# EAGLE design Diag_586220_Cassette (EAGLE 9.5.2)
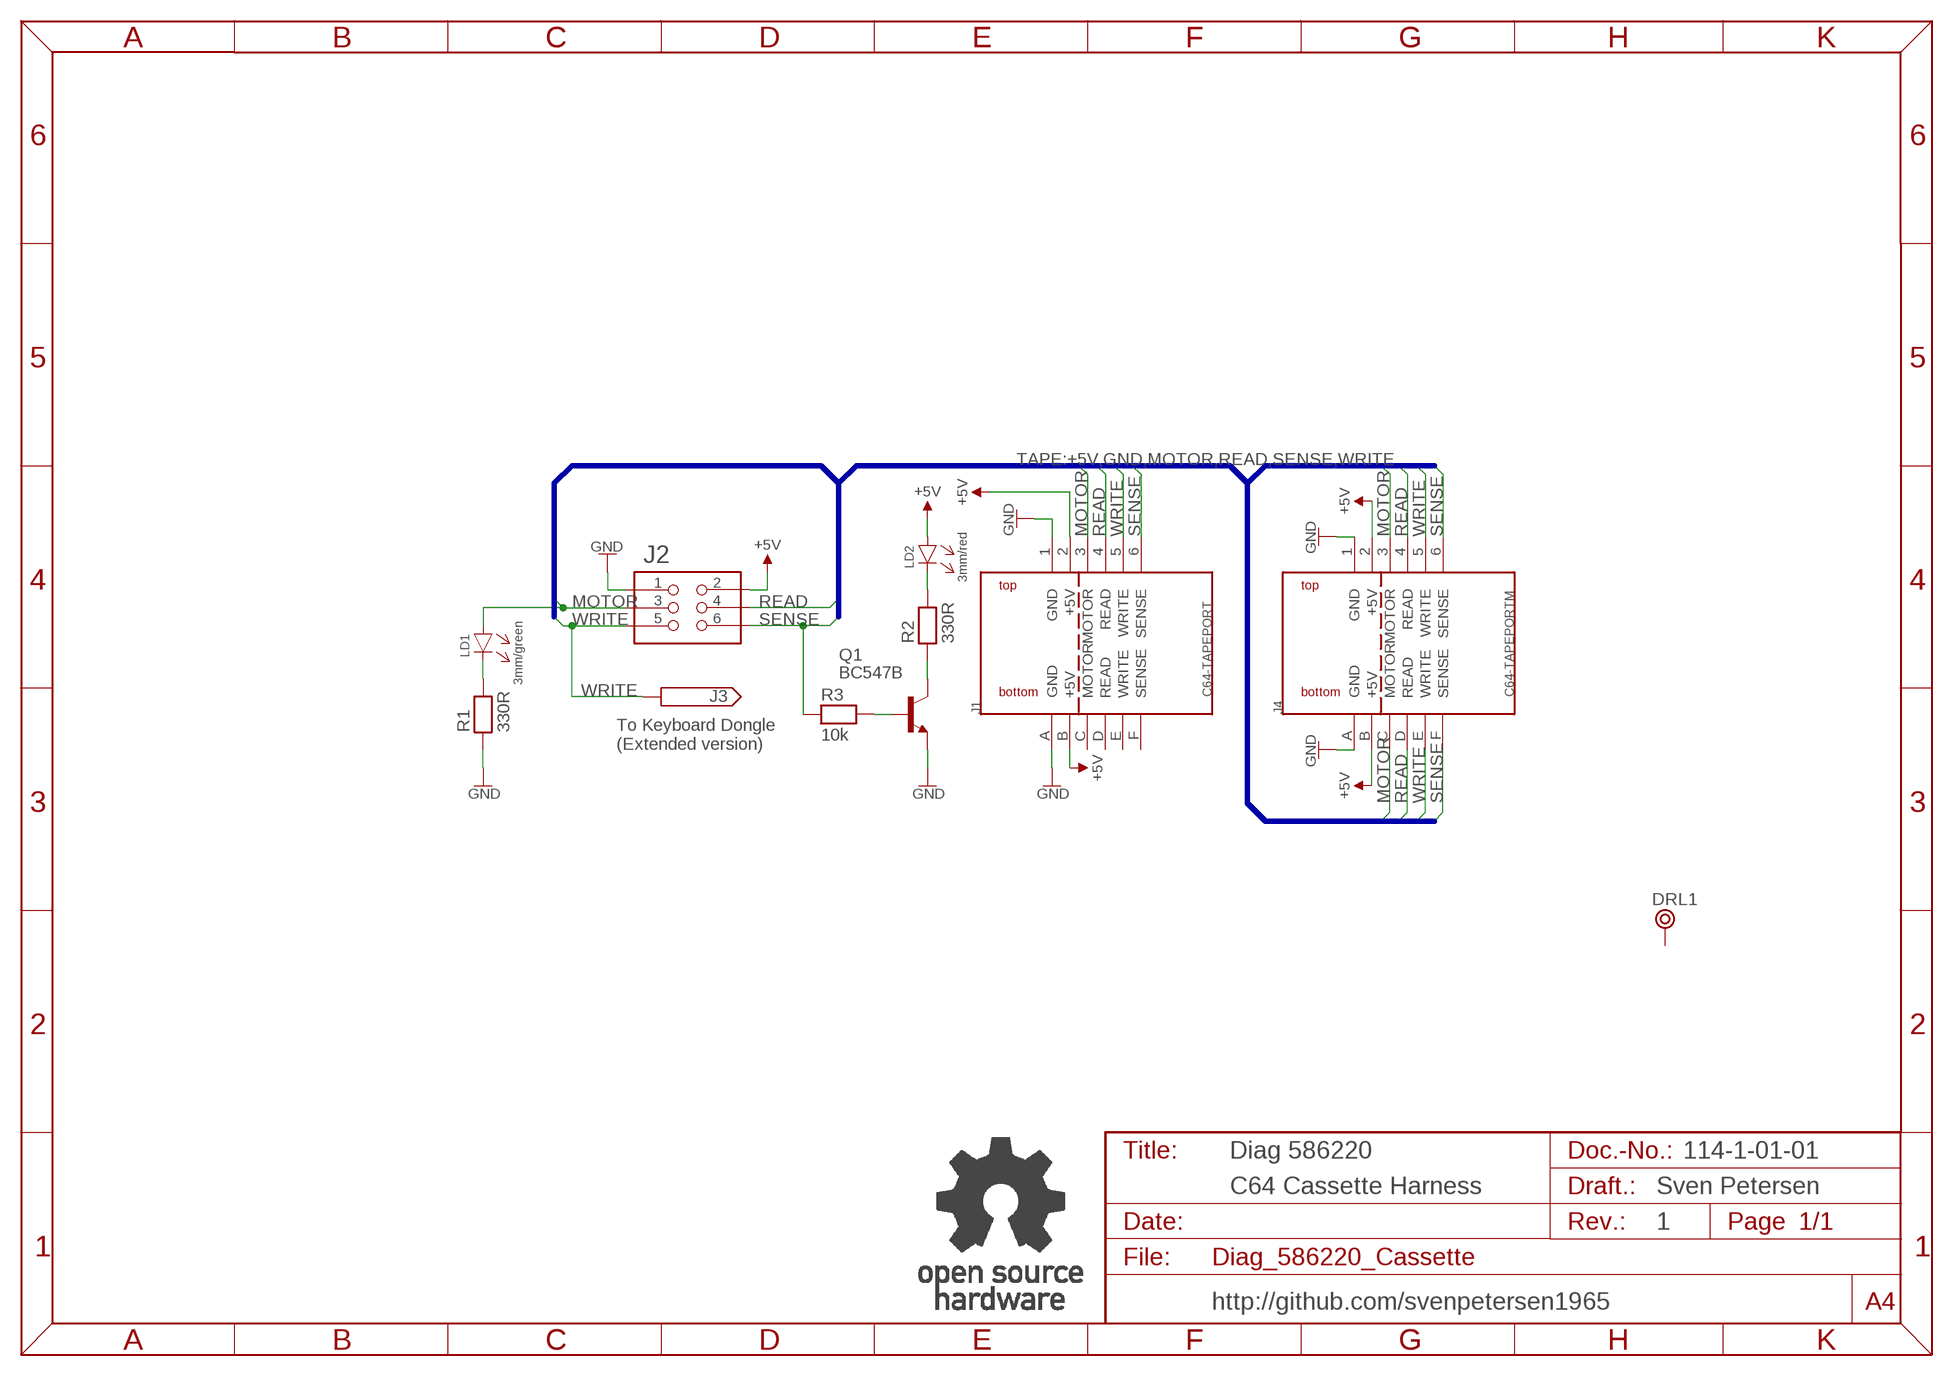
[diagram p0: schematic, sheet 1]

## Parts
DRL1  BOHR3,5  [BOHR3,5]
J1  C64-TAPEPORT  [TAPEPORT]
J2  2X03WV  [2X03WV]
J3  PINHD-1X1  [1X01]
J4  C64-TAPEPORTM  [TAPEPORT_M]
LD1  3mm/green  3MM  [3MM]
LD2  3mm/red  3MM  [3MM]
Q1  BC547B  [TO92]
R1  330R  RES04  [R-10]
R2  330R  RES04  [R-10]
R3  10k  RES04  [R-10]
U$18  OPEN_SOURCE_HW  [OPENHW]

## Nets
+5V: J1.2(+5V) J1.B(+5V) J2.2 J4.2(+5V) J4.B(+5V) LD2.A
GND: J1.1(GND) J1.A(GND) J2.1 J4.1(GND) J4.A(GND) Q1.1(E) R1.1
MOTOR: J1.3(MOTOR) J2.3 J4.3(MOTOR) J4.C(MOTOR) LD1.A
N$1: LD1.C(K) R1.2
N$2: Q1.2(B) R3.2
N$3: Q1.3(C) R2.1
N$4: LD2.C(K) R2.2
READ: J1.4(READ) J2.4 J4.4(READ) J4.D(READ)
SENSE: J1.6(SENSE) J2.6 J4.6(SENSE) J4.F(SENSE) R3.1
WRITE: J1.5(WRITE) J2.5 J3.1 J4.5(WRITE) J4.E(WRITE)
Unconnected: DRL1.P$1 J1.C(MOTOR) J1.D(READ) J1.E(WRITE) J1.F(SENSE)

## Buses
TAPE:+5V,GND,MOTOR,READ,SENSE,WRITE

## Notes on the sheet
- To Keyboard Dongle 
  (Extended version)
- Diag 586220 | 114-1-01-01
- C64 Cassette Harness | Sven Petersen
- 1
- http://github.com/svenpetersen1965

## Library data of the parts
DRL1 = Mech_Bohr:BOHR3,5
J1 J4 = Commodore:C64-TAPEPORT
J2 = PINHEAD:2X03WV
J3 = PINHEAD:PINHD-1X1
LD1 LD2 = LED:3MM
Q1 = Transistoren:BC547*: NPN Transistor
R1-R3 = DISCRETE:RES04
U$18 = Logo:OPEN_SOURCE_HW

## Board
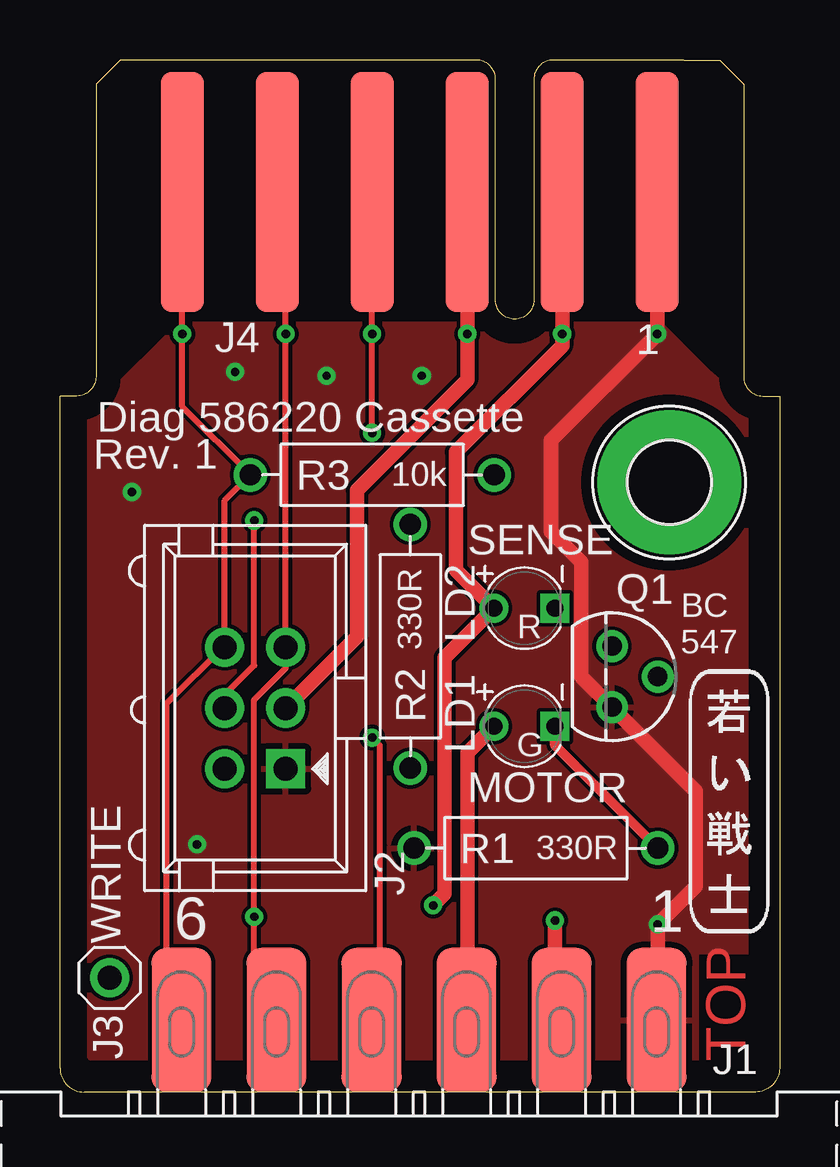
[diagram p1: board, top side]
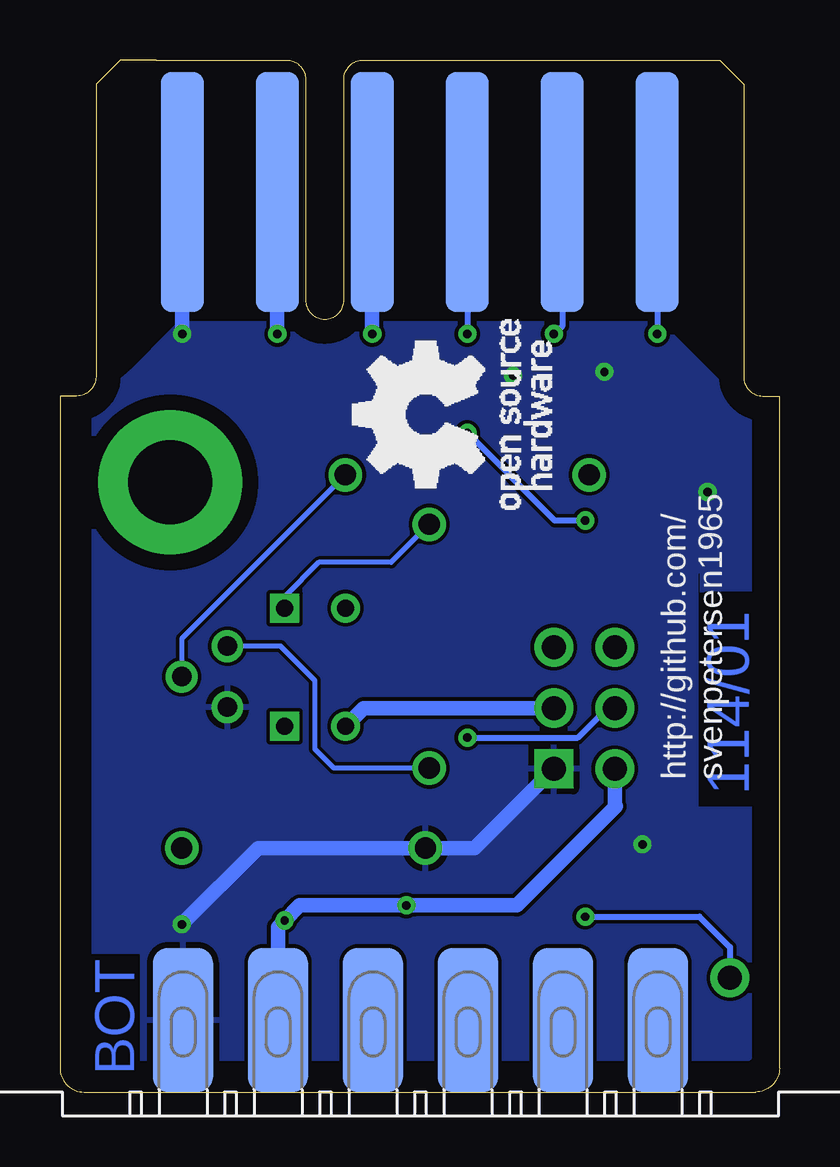
[diagram p2: board, bottom side, seen from below]

Size 30 x 43 mm. Coordinates in mm from the lower left corner, seen from the top.
Outline: 28.5,31 28.5,29.8 arc90 29.3,29 30,29 30,1 arc-90 29,0 1,0 arc-90 0,1 0,29 0.7,29 arc90 1.5,29.8 1.5,31
Copper layers (1*16): Top 0.035mm / dielectric 1.5mm / Bottom 0.035mm
Design rules "default *": minimum track width 6mil, minimum drill 0.35mm, track to track 6mil, track to pad 6mil, pad to pad 6mil, via to via 6mil, smd to smd 6mil, copper to edge 40mil, drill to drill 6mil, minimum pad ring 10mil, minimum via ring 8mil, stop-mask expansion 4mil, vias tented up to drill 24mil, thermal gap 10mil
bRestrict: 2 lines

### Footprints (pad centres in the part's own frame; a part is rotated, then mirrored left to right if it is on the bottom)
BOHR3,5 = drill 3.5 pad 6: P$1 0,0
TAPEPORT = smd 2.5 x 6: 1 -9.9,-3; 2 -5.94,-3; 3 -1.98,-3; 4 1.98,-3; 5 5.94,-3; 6 9.9,-3 | smd 2.5 x 6 bottom: A -9.9,-3; B -5.94,-3; C -1.98,-3; D 1.98,-3; E 5.94,-3; F 9.9,-3
2X03WV = drill 1 pad 1.626 square: 1 -2.54,-1.27 | drill 1 pad 1.626: 2 -2.54,1.27; 3 0,-1.27; 4 0,1.27; 5 2.54,-1.27; 6 2.54,1.27
1X01 = drill 1 pad 1.626: 1 0,0
TAPEPORT_M = smd 1.8 x 10: 1 -9.9,5.5; 2 -5.94,5.5; 3 -1.98,5.5; 4 1.98,5.5; 5 5.94,5.5; 6 9.9,5.5 | smd 1.8 x 10 bottom: A -9.9,5.5; B -5.94,5.5; C -1.98,5.5; D 1.98,5.5; E 5.94,5.5; F 9.9,5.5
3MM = drill 0.7: A -1.27,0 | drill 0.7 square: C 1.27,0
TO92 = drill 0.813: 1 1.27,0; 2 0,1.905; 3 -1.27,0
R-10 = drill 0.889 pad 1.397: 1 -5.08,0; 2 5.08,0

### Placement (x,y rotation side)
DRL1  25.4,25.4 0 top
J1  14.97,0 180 top
J2  8.14,16 90 top
J3  2.06,4.76 90 top
J4  15,43 180 top
LD1  19.37,15.24 0 top
LD2  19.37,20.16 0 top
Q1  23.02,17.3 270 top
R1  19.84,10.16 0 top
R2  14.61,18.57 90 top
R3  13.02,25.72 0 top
U$5  [PCB-TITLE/]  0.16,53.72 0 top  (outside the outline)
U$6  [2LAYER]  28.57,1.27 90 top
U$11  [SVEN_TAG]  27.94,12.22 0 top
U$18  9.53,24.29 90 bottom

### Tracks (layer width: path | path; a pad name or v marks a point on that pad's centre or on a via)
+5V  (via drill 0.35)
  Top 0.61: v20.64,7.14 20.64,3.27 J1.B | v15.56,7.78 16.03,8.26 16.03,18.1 LD2.A 16.51,21.75 16.51,26.67 20.94,31.1 v20.94,31.59 J4.B
  Bottom 0.406: 15.24,7.78 v15.56,7.78
  Bottom 0.61: J1.B 20.91,6.87 v20.64,7.14 20,7.78 v15.56,7.78 | J2.2 6.87,11.95 6.83,11.91 10.95,7.78 15.24,7.78 | J4.B v20.94,31.59
GND  (via drill 0.35)
  Top 0.61: J1.1 24.92,3.05 v24.92,6.99 26.51,8.57 26.51,12.54 Q1.1 21.75,17.3 21.75,22.07 20.48,23.34 20.48,27.15 24.9,31.57 v24.9,31.59 J4.A
  Bottom 0.61: v24.92,6.99 21.75,10.16 R1.1 12.71,10.16 J2.1 | J4.A 24.9,31.61 24.92,31.59 v24.9,31.59
  other vias: 3,25 11.11,29.84 15.08,29.84 7.3,30 5.71,10.32
  pour Top: 1.27,28.65 1.32,28.65 arc45 1.89,28.89 5,32 24.67,32 arc-45 25.23,31.77 27,30 28.57,28.65 28.57,1.43 1.27,1.43
  pour Bottom: 1.27,28.65 1.32,28.65 arc45 1.89,28.89 5,32 24.67,32 arc-45 25.23,31.77 27,30 28.57,28.65 28.57,1.43 1.27,1.43
MOTOR  (via drill 0.35)
  Top 0.254: J1.3 16.99,3.04
  Top 0.61: 16.99,3.04 16.99,14.13 LD1.A | J2.3 12.38,18.97 12.38,25.08 16.98,29.68 v16.98,31.59 J4.3
  Bottom 0.61: LD1.A 17.34,16 J2.3 | J4.3 v16.98,31.59
N$1
  Top 0.406: R1.2 20.64,14.45 LD1.C
N$2
  Bottom 0.203: R3.2 24.92,18.89 Q1.2
N$3
  Bottom 0.203: R2.1 18.57,13.49 19.37,14.29 19.37,17.14 20.8,18.57 21.43,18.57 | 21.43,18.57 Q1.3 | 21.43,18.57
N$4
  Bottom 0.203: R2.2 16.19,22.07 19.21,22.07 20.64,20.64 LD2.C
READ  (via drill 0.35)
  Top 0.254: v13.02,14.76 13.34,14.45 13.34,3.17 13.16,3 J1.4 | J2.4 6.87,16.55 8.1,17.78 v8.1,23.81 | v13.02,27.46 v13.02,31.59 J4.4
  Bottom 0.254: v13.02,14.76 8.41,14.76 7.18,16 J2.4 | v8.1,23.81 9.37,23.81 v13.02,27.46 | J4.4 v13.02,31.59
SENSE  (via drill 0.35)
  Top 0.254: J1.6 4.45,3.62 4.45,16.19 6.79,18.54 J2.6 6.87,24.65 R3.1 5.1,28.55 v5.1,31.59 J4.6
  Bottom 0.254: J4.6 5.1,31.61 5.08,31.59 v5.1,31.59
WRITE  (via drill 0.35)
  Top 0.152: 8.1,7.14 v8.1,7.3
  Top 0.203: 9.41,37.15 J4.5
  Top 0.254: J1.5 8.1,3.93 8.1,7.14 | 9.41,37.15 v9.41,31.59 J2.5 9.41,17.66 8.1,16.35 v8.1,7.3
  Bottom 0.254: v8.1,7.3 3.33,7.3 2.06,6.03 J3.1 | J4.5 9.06,31.9 9.37,31.59 v9.41,31.59

### Text on the board
Bottom: 114/01
tPlace: Diag 586220 Cassette | Rev. 1 | SENSE | MOTOR | 1 | WRITE | 6
bPlace: http://github.com/ / svenpetersen1965
tNames: 10k | R | 330R | BC / 547 | G | 330R
Document: 114-2-01-01 | Diag 586220 / Harness | 35µm | 2 | 1